# EAGLE schematic adc (EAGLE 9.2.0)
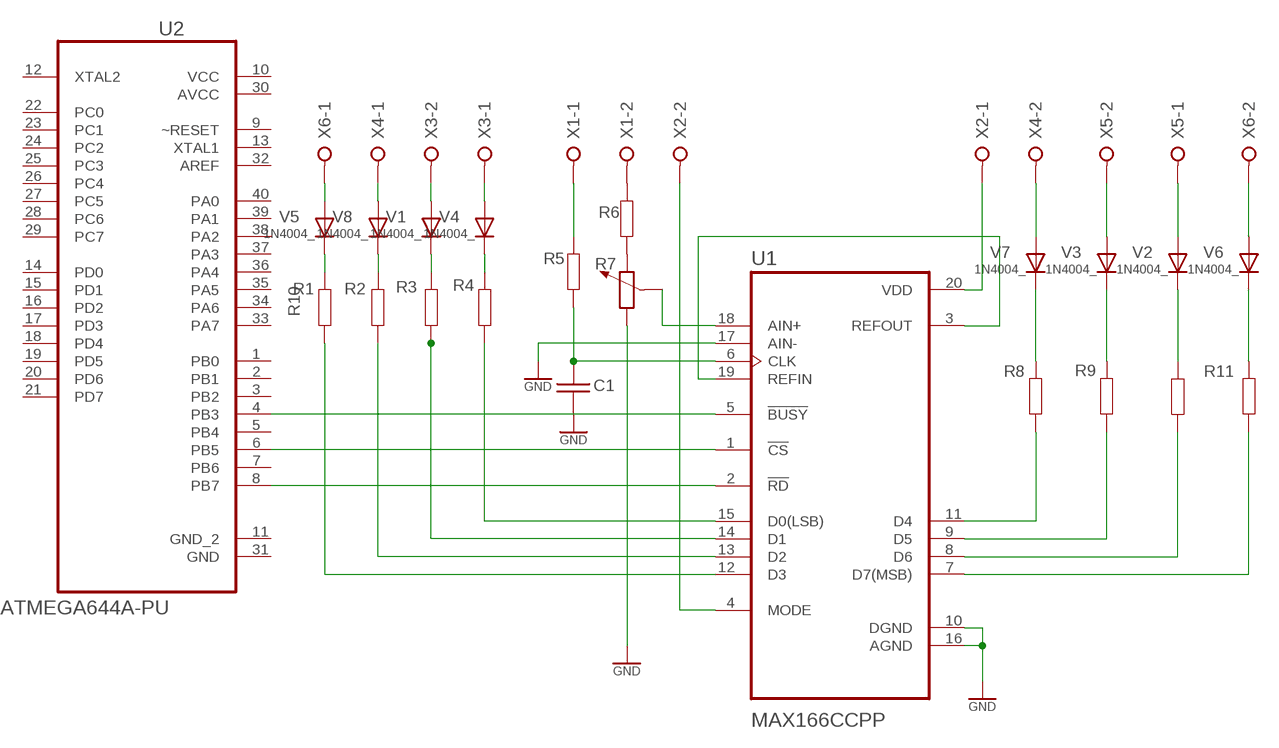
[diagram p0: schematic, sheet 1]

## Parts
C1  C-V_025-024X044  [C025-024X044]
R1  RCL_R-EU_0204/2V  [MYRCL_0204V]
R2  RCL_R-EU_0204/2V  [MYRCL_0204V]
R3  RCL_R-EU_0204/2V  [MYRCL_0204V]
R4  RCL_R-EU_0204/2V  [MYRCL_0204V]
R5  RCL_R-EU_0204/2V  [MYRCL_0204V]
R6  RCL_R-EU_0204/2V  [MYRCL_0204V]
R7  RCL_R-EU_0204/2V  [MYRCL_0204V]
R8  RCL_R-EU_0204/2V  [MYRCL_0204V]
R9  RCL_R-EU_0204/2V  [MYRCL_0204V]
R10  RCL_R-EU_0204/2V  [MYRCL_0204V]
R11  R-POT_V_PT-10  [PT-10]
U1  MAX166CCPP  [DIP794W47P254L2654H457Q20]
U2  ATMEGA644A-PU  [DIP254P1524X483-40]
V1  1N4004_  [DO41-10]
V2  1N4004_  [DO41-10]
V3  1N4004_  [DO41-10]
V4  1N4004_  [DO41-10]
V5  1N4004_  [DO41-10]
V6  1N4004_  [DO41-10]
V7  1N4004_  [DO41-10]
V8  1N4004_  [DO41-10]
X1  W237-3E  [W237-3E]
X2  W237-3E  [W237-3E]
X3  W237-3E  [W237-3E]
X4  W237-3E  [W237-3E]
X5  W237-3E  [W237-3E]
X6  5V  W237-3E  [W237-3E]

## Nets
GND: C1.2 R11.1 U1.17(AIN-)
N$1: U1.10(DGND) U1.16(AGND) ; supply symbol labelled GND
N$2: C1.1 R1.1 U1.6(CLK)
N$3: R1.2 X1.1
N$4: R11.3 U1.18(AIN+)
N$5: R2.1 R11.2
N$6: R2.2 X1.2
N$7: U1.3(REFOUT) U1.19(REFIN)
N$8: U1.5(!BUSY) U2.4(PB3)
N$9: U1.1(!CS) U2.6(PB5)
N$10: U1.2(!RD) U2.8(PB7)
N$11: U1.20(VDD) X2.1
N$12: U1.4(MODE) X2.2
N$13: R9.1 U1.15(D0(LSB))
N$14: R9.2 V4.C
N$15: V4.A X3.1
N$16: R6.1 U1.14(D1)
N$17: R6.2 V1.C
N$18: V1.A X3.2
N$19: R7.1 U1.13(D2)
N$20: R7.2 V8.C
N$21: V8.A X4.1
N$22: R10.2 V5.C
N$23: R10.1 U1.12(D3)
N$24: R3.2 V7.C
N$25: R3.1 U1.11(D4)
N$26: V7.A X4.2
N$27: R4.2 V3.C
N$28: R4.1 U1.9(D5)
N$29: V3.A X5.2
N$30: R8.1 U1.8(D6)
N$31: R8.2 V2.C
N$32: V2.A X5.1
N$33: R5.1 U1.7(D7(MSB))
N$34: R5.2 V6.C
N$35: V6.A X6.2
N$36: V5.A X6.1
Unconnected: U2.1(PB0) U2.2(PB1) U2.3(PB2) U2.5(PB4) U2.7(PB6) U2.9(~RESET) U2.11(GND_2) U2.12(XTAL2) U2.13(XTAL1) U2.14(PD0) U2.15(PD1) U2.16(PD2) U2.17(PD3) U2.18(PD4) U2.19(PD5) U2.20(PD6) U2.21(PD7) U2.22(PC0) U2.23(PC1) U2.24(PC2) U2.25(PC3) U2.26(PC4) U2.27(PC5) U2.28(PC6) U2.29(PC7) U2.31(GND) U2.32(AREF) U2.33(PA7) U2.34(PA6) U2.35(PA5) U2.36(PA4) U2.37(PA3) U2.38(PA2) U2.39(PA1) U2.40(PA0) X1.3 X2.3 X3.3 X4.3 X5.3 X6.3

## Power pins joined to a net without a drawn wire
AVCC: U2.30(AVCC)
VCC: U2.10(VCC)

## Library data of the parts
C1 = rcl_TicA:C-V_: CAPACITOR, European symbol
R1-R10 = rcl_TicA:RCL_R-EU_: RESISTOR, European symbol
R11 = rcl_TicA:R-POT_V_: Potentiometer
U1 = MAX166CCPP:MAX166CCPP; DESCRIPTION: 8 Bit Analog to Digital Converter 1 Input 1 SAR 20-PDIP; DIGI-KEY_PART_NUMBER: MAX166CCPP+-ND; DIGI-KEY_PURCHASE_URL: https://www.digikey.com/product-detail/en/maxim-integrated/MAX166CCPP-/MAX166CCPP--ND/1511997?utm_source=snapeda&utm_medium=aggregator&utm_campaign=symbol; MF: Maxim Integrated; MP: MAX166CCPP+; PACKAGE: PDIP-20 Maxim
U2 = ATMEGA644A-PU:ATMEGA644A-PU: 8-bit Microcontroller with In-System Programmable Flash; AVAILABILITY: Unavailable; DESCRIPTION: AVR AVR® ATmega Microcontroller IC 8-Bit 20MHz 64KB _32K x 16_ FLASH 40-PDIP; MF: Microchip; MP: ATMEGA644A-PU; PACKAGE: DIP-40 Microchip; PRICE: None
V1-V8 = diode_TicA:1N4004_: DIODE general purpose rectifier, 1 A
X1-X6 = con-wago-508:W237-3E: WAGO SREW CLAMP; OC_FARNELL: unknown; OC_NEWARK: unknown